# Altium schematic sheet BSPD_DiagrBloques_SCH.SchDoc: BSPD - Diagrama en bloques
size A4; Author: FSAE MotorSport UTN; Revision: 1.0; SheetNumber: 1; SheetTotal: 3
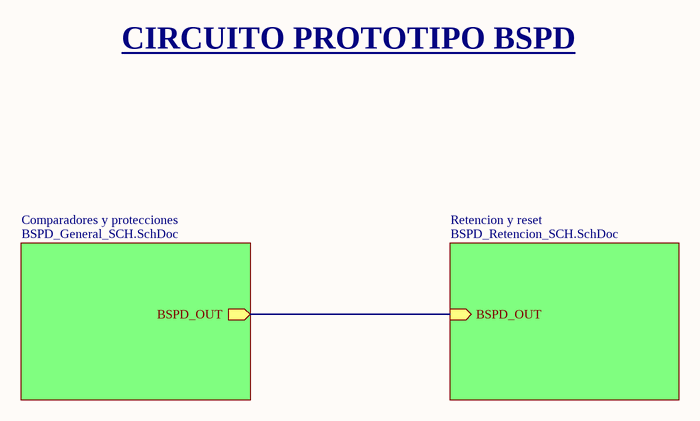
[diagram p0: BSPD_DiagrBloques_SCH.SchDoc]

## Sub-sheets
Comparadores y protecciones = BSPD_General_SCH.SchDoc: BSPD_OUT (out)
Retencion y reset = BSPD_Retencion_SCH.SchDoc: BSPD_OUT (in)

## Nets
(unnamed): sheet Comparadores y protecciones/BSPD_OUT, sheet Retencion y reset/BSPD_OUT

## Notes on the sheet
- CIRCUITO PROTOTIPO BSPD
- Title:
- Size:
- Author:
- A4
- Sheet
- of
- Revision:
- File:
- Date: